# Altium schematic sheet Sheet1.SchDoc
size A3
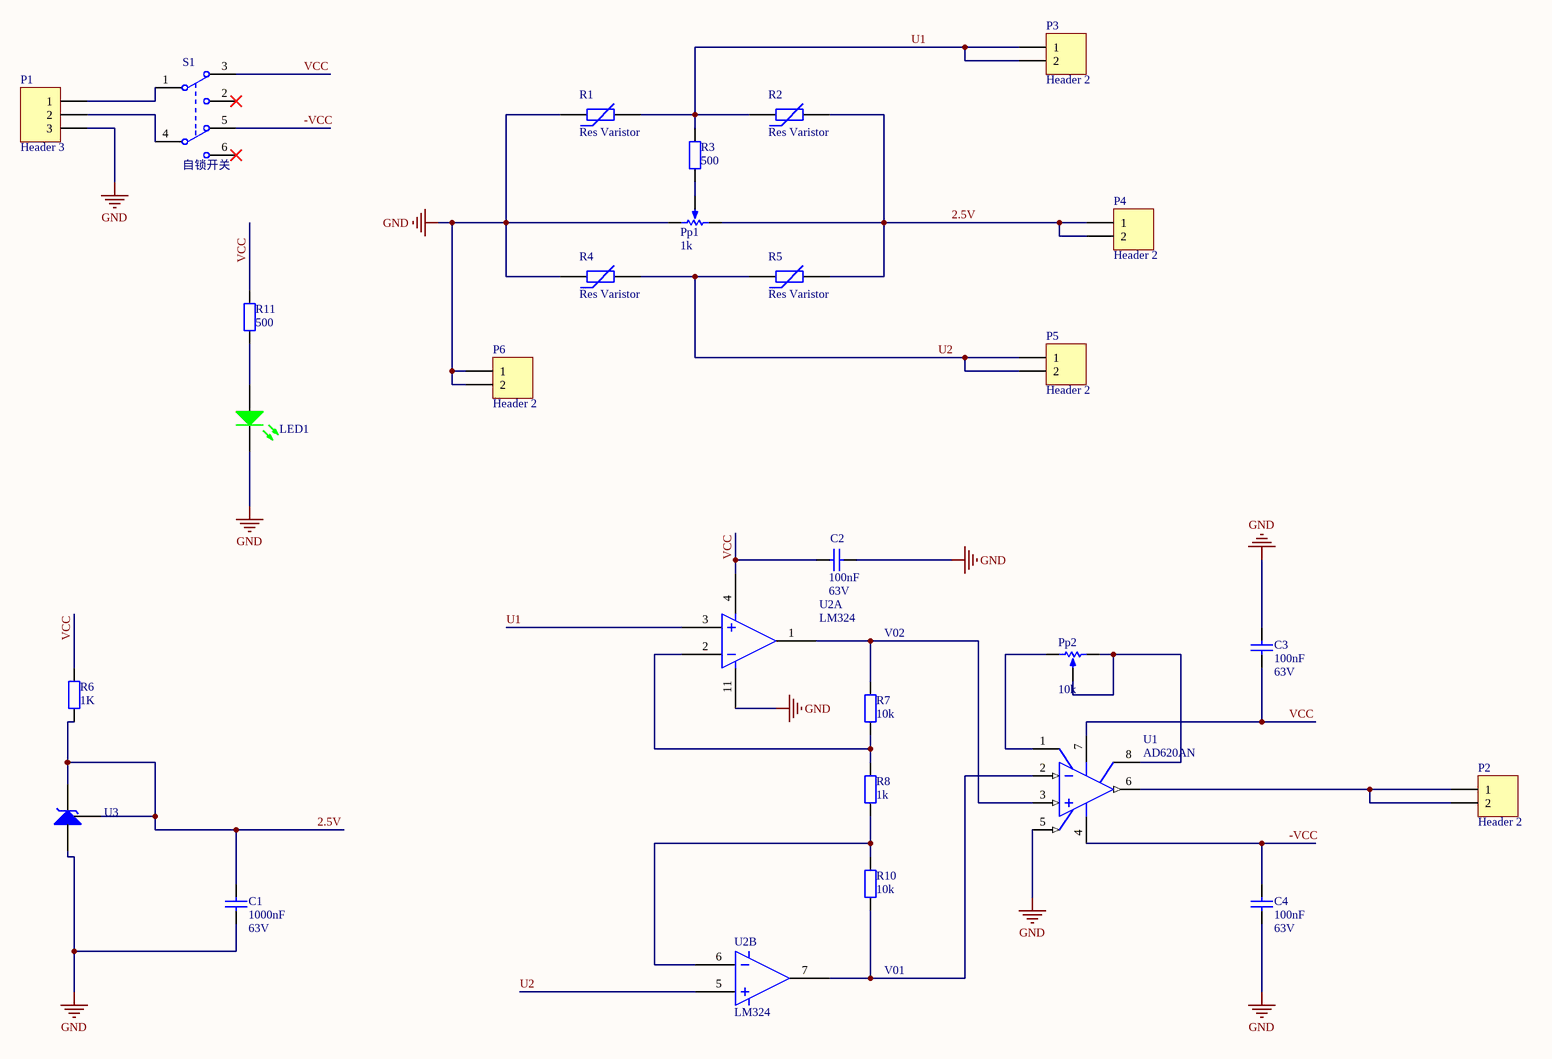
[diagram p0: Sheet1.SchDoc]

## Parts
C1  value 1000nF  Voltage: 63V  [Capacitor-Disk-Middle]  (hidden comment: Cap Nicklon)
C2  value 100nF  Voltage: 63V  [Capacitor-Disk-Middle]  (hidden comment: Cap Nicklon)
C3  value 100nF  Voltage: 63V  [Capacitor-Disk-Middle]  (hidden comment: Cap Nicklon)
C4  value 100nF  Voltage: 63V  [Capacitor-Disk-Middle]  (hidden comment: Cap Nicklon)
LED1  LED-3-G  [LED-R3-H5-SINGLE-G]  (value not drawn)
P1  Header 3  [HX2.54-3]
P2  Header 2  [HDR1X2]
P3  Header 2  [HDR1X2]
P4  Header 2  [HDR1X2]
P5  Header 2  [HDR1X2]
P6  Header 2  [HDR1X2]
Pp1  1k  [RP_3296]
Pp2  10k  [RP_3296]
R1  Res Varistor  [RESC2012N]
R2  Res Varistor  [RESC2012N]
R3  value 500  [AXIAL-0.3]  (hidden comment: Resistor)
R4  Res Varistor  [RESC2012N]
R5  Res Varistor  [RESC2012N]
R6  value 1K  [AXIAL-0.3]  (hidden comment: Resistor)
R7  value 10k  [AXIAL-0.3]  (hidden comment: Resistor)
R8  value 1k  [AXIAL-0.3]  (hidden comment: Resistor)
R10  value 10k  [AXIAL-0.3]  (hidden comment: Resistor)
R11  value 500  [AXIAL-0.3]  (hidden comment: Resistor)
S1  自锁开关  [sw_8.5mm]
U1  AD620AN  [N-8]
U2  LM324  [DIP-14]  (parts A,B of 4)
U3  TL431  [BCY-W3/E4]  (value not drawn)

## Nets
GND: C1.1 C2.1 C3.1 C4.1 LED1.2(K) P1.3 P6.1 P6.2 Pp1.3(BOT) R1.1 R4.1 U1.5(REF) U2.11 U3.2(A)
2.5V: C1.2 P4.1 P4.2 Pp1.1(TOP) R2.2 R5.2 R6.1 U3.1(R) U3.3(K)
-VCC: C4.2 S1.5 U1.4(V-)
U1: P3.1 P3.2 R1.2 R2.1 R3.1 U2.3
U2: P5.1 P5.2 R4.2 R5.1 U2.5
VCC: C2.2 C3.2 R6.2 R11.2 S1.3 U1.7(V+) U2.4
NetLED1_1: LED1.1(A) R11.1
NetP1_1: P1.1 S1.1
NetP1_2: P1.2 S1.4
NetP2_1: P2.1 P2.2 U1.6(OUT)
NetPp1_2: Pp1.2(TAP) R3.2
NetPp2_1: Pp2.1(TOP) U1.1(RG)
NetPp2_2: Pp2.2(TAP) Pp2.3(BOT) U1.8(RG)
NetR7_1: R7.1 U1.3(+IN) U2.1
NetR7_2: R7.2 R8.1 U2.2
NetR8_2: R8.2 R10.1 U2.6
NetR10_2: R10.2 U1.2(-IN) U2.7

Not connected (* = marked no-connect by the designer): S1 2* 6*

## Notes on the sheet
- V02
- V01

## Library data of the parts
C1-C4 = Cap Nicklon: CBB聚乙烯薄膜电容; Published: 8-Jun-2000; Revision: July-2002: Re-released for DXP Platform.; Publisher: Altium Limited; 实物样品照片: https://item.taobao.com/item.htm?spm=a230r.1.14.32.21fd24b7VWml4d&id=37914290992&ns=1&abbucket=13#detail
LED1 = LED-3-G: Typical INFRARED GaAs LED; Published: 8-Jun-2000; Revision: July-2002: Re-released for DXP Platform.; Publisher: Altium Limited
P1 = Header 3: Header, 3-Pin; LatestRevisionDate: 17-Jul-2002; LatestRevisionNote: Re-released for DXP Platform.; Publisher: Altium Limited
P2-P6 = Header 2: Header, 2-Pin; LatestRevisionDate: 17-Jul-2002; LatestRevisionNote: Re-released for DXP Platform.; Publisher: Altium Limited
Pp1 Pp2 = RP_3296: 3296电位器; 购买链接: https://item.taobao.com/item.htm?spm=a230r.1.14.90.21641e34zQj3ul&id=19303265869&ns=1&abbucket=13#detail
R1 R2 R4 R5 = Res Varistor: 贴片压敏电阻; Published: 24-Mar-1999; LatestRevisionDate: 29-May-2009; LatestRevisionNote: IPC-7351 Footprint Added.; PackageVersion: Mar-2003; PackageReference: 6-0805; Publisher: Altium Limited; PackageDescription: Chip Resistor 0805 Case Size; Code_IPC: RESC2012
S1 = SW DPDT
U1 = AD620AN: Low-Cost, Low-Power Instrumentation Amplifier; Published: 8-Jun-2000; LatestRevisionDate: 04-Mar-2005; LatestRevisionNote: Stylized 3D Model Added.; DatasheetVersion: REV.D 1998; PackageVersion: revA; PackageReference: N-8; Publisher: Altium Limited; PackageDescription: DIP; 8 Leads; Row Spacing 7.62 mm; Pitch 2.54 mm; ComponentLink1Description: Manufacturer Link; ComponentLink1URL: http://www.analog.com/en/prod/0%2C2877%2CAD620%2C00.html; ComponentLink2Description: Datasheet; ComponentLink2URL: http://www.analog.com/UploadedFiles/Data_Sheets/897653854AD620_g.pdf
R3 R6-R8 R10 R11 = Resistor: Published: 8-Jun-2000; Revision: July-2002: Re-released for DXP Platform.; Publisher: Altium Limited